# Altium schematic sheet SCH_2022-03-13.schdoc
size 288 x 399 mm
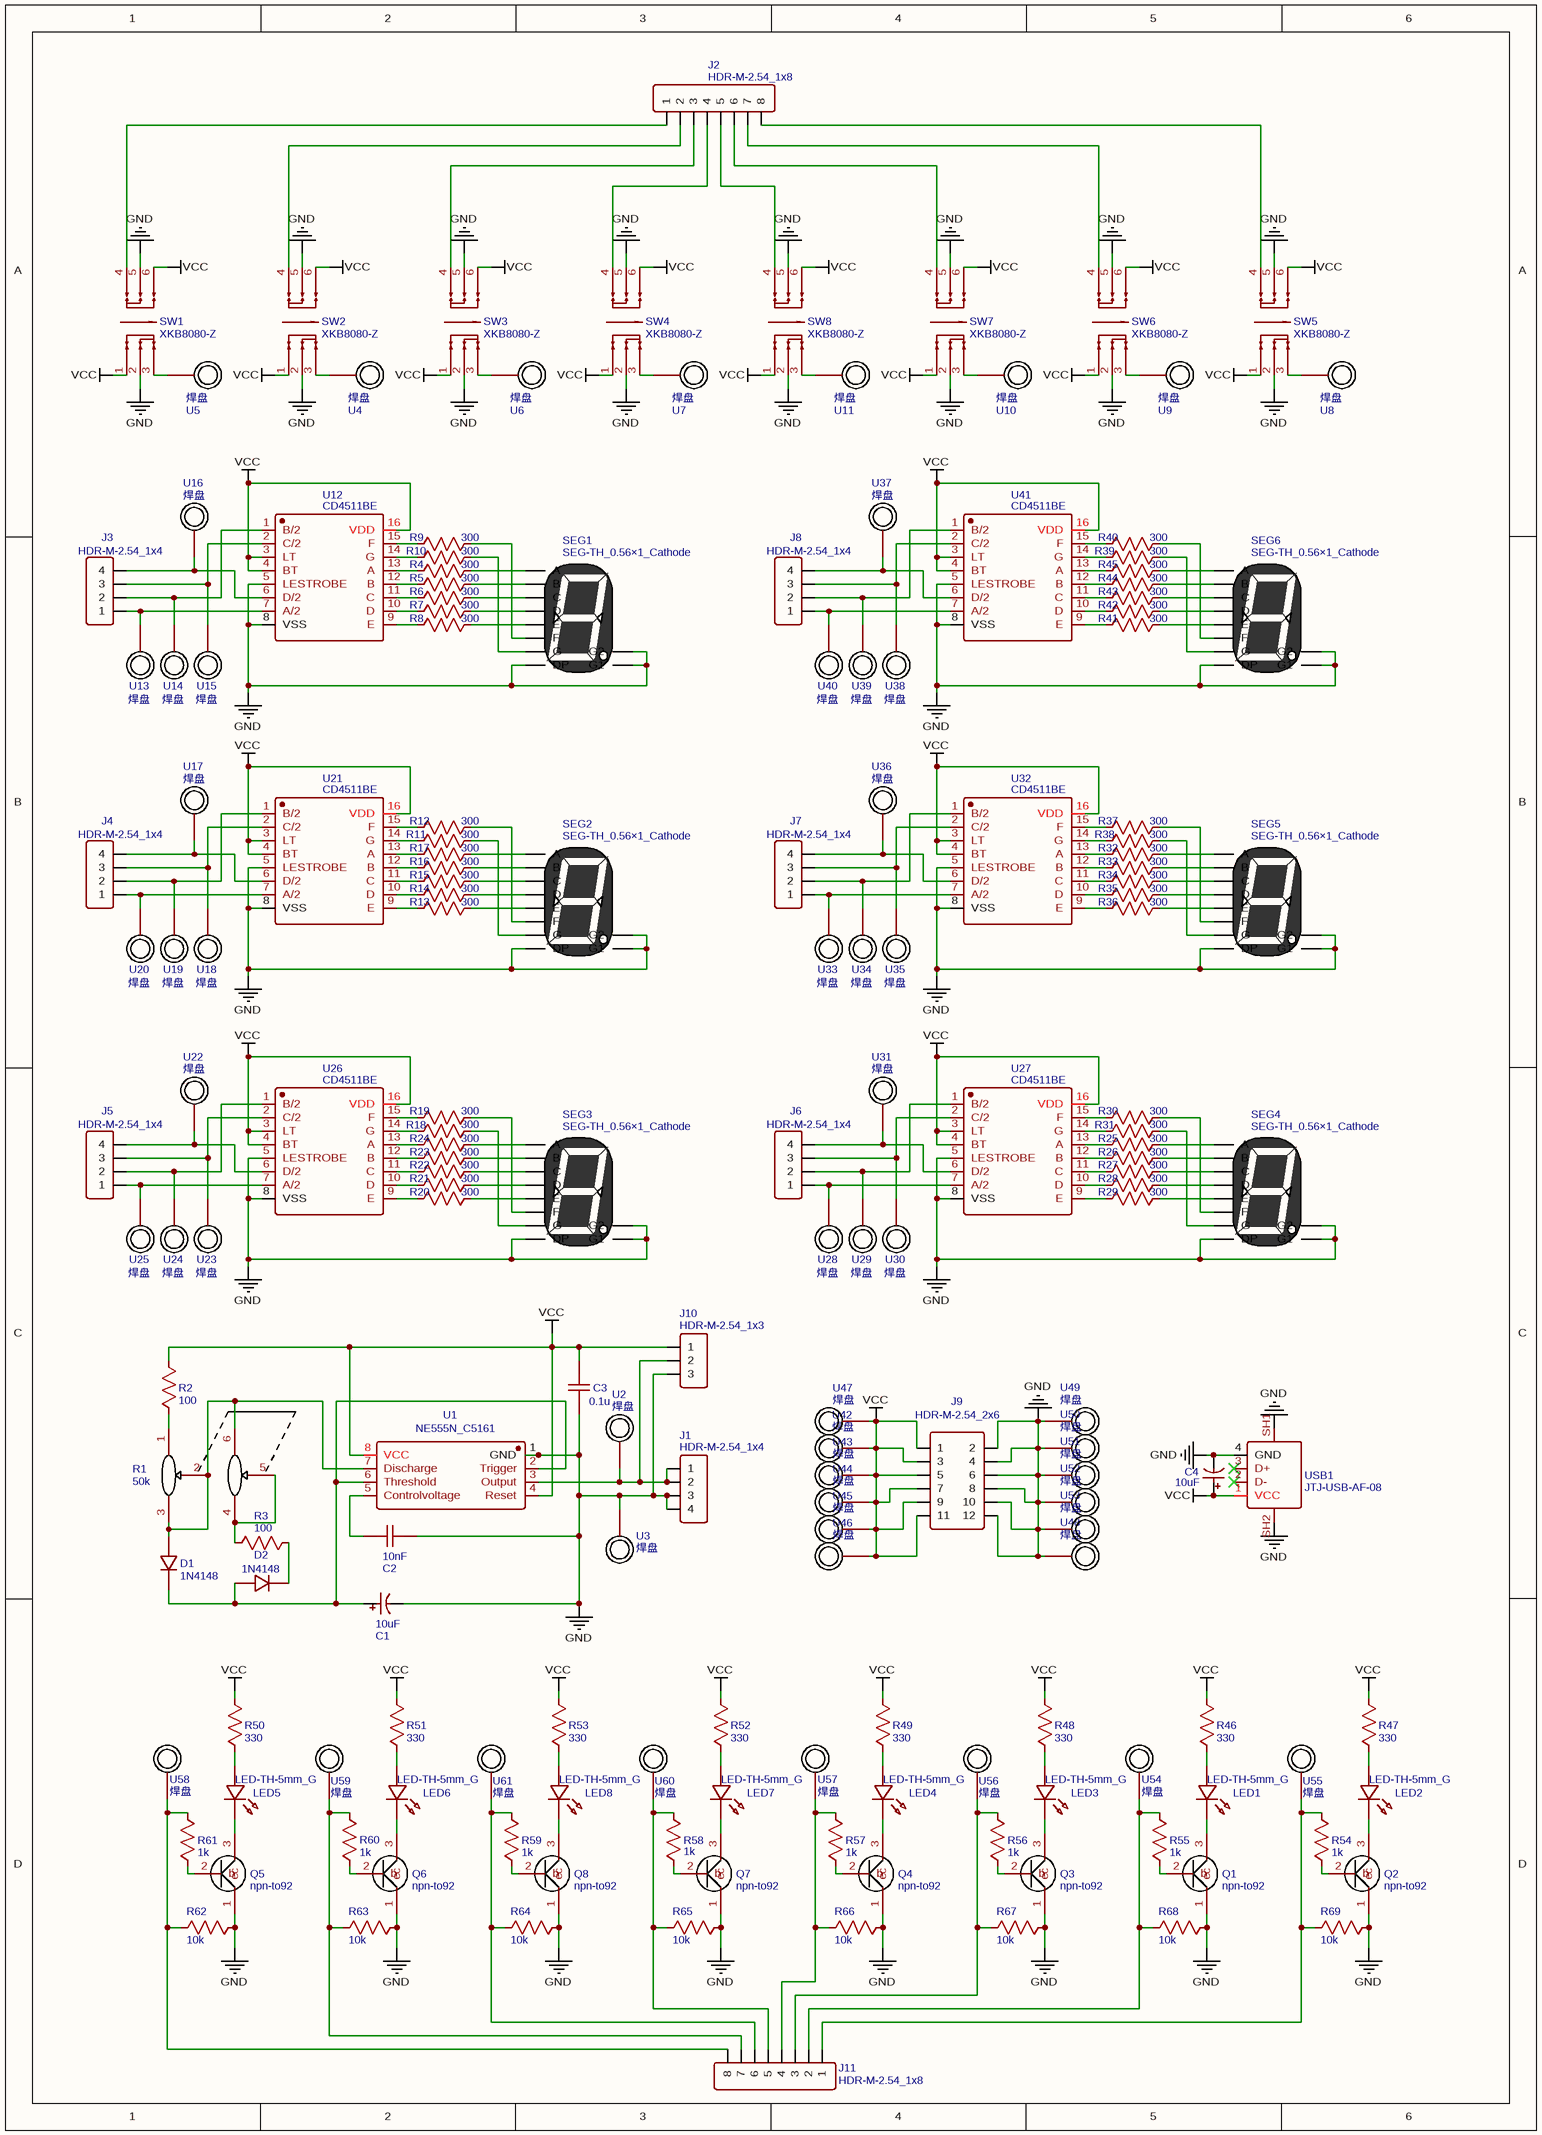
[diagram p0: SCH_2022-03-13.schdoc]

## Parts
C1  10uF  [CAP-TH_BD1.0-P2.54-D6.3-FD]
C2  10nF  [RAD-0.2]
C3  0.1u  [RAD-0.2]
C4  10uF  [CAP-TH_BD1.0-P2.54-D6.3-FD]
D1  1N4148  [DO-35_BD2.0-L4.2-P8.20-D0.5-RD]
D2  1N4148  [DO-35_BD2.0-L4.2-P8.20-D0.5-RD]
J1  HDR-M-2.54_1x4  [HDR-M-2.54_1X4]
J2  HDR-M-2.54_1x8  [HDR-M-2.54_1X8]
J3  HDR-M-2.54_1x4  [HDR-M-2.54_1X4]
J4  HDR-M-2.54_1x4  [HDR-M-2.54_1X4]
J5  HDR-M-2.54_1x4  [HDR-M-2.54_1X4]
J6  HDR-M-2.54_1x4  [HDR-M-2.54_1X4]
J7  HDR-M-2.54_1x4  [HDR-M-2.54_1X4]
J8  HDR-M-2.54_1x4  [HDR-M-2.54_1X4]
J9  HDR-M-2.54_2x6  [HDR-M-2.54_2X6]
J10  HDR-M-2.54_1x3  [HDR-M-2.54_1X3]
J11  HDR-M-2.54_1x8  [HDR-M-2.54_1X8]
LED1  LED-TH-5mm_G  [LED-TH_BD5.0_GREEN]
LED2  LED-TH-5mm_G  [LED-TH_BD5.0_GREEN]
LED3  LED-TH-5mm_G  [LED-TH_BD5.0_GREEN]
LED4  LED-TH-5mm_G  [LED-TH_BD5.0_GREEN]
LED5  LED-TH-5mm_G  [LED-TH_BD5.0_GREEN]
LED6  LED-TH-5mm_G  [LED-TH_BD5.0_GREEN]
LED7  LED-TH-5mm_G  [LED-TH_BD5.0_GREEN]
LED8  LED-TH-5mm_G  [LED-TH_BD5.0_GREEN]
Q1  npn-to92  [NPN——TO92]
Q2  npn-to92  [NPN——TO92]
Q3  npn-to92  [NPN——TO92]
Q4  npn-to92  [NPN——TO92]
Q5  npn-to92  [NPN——TO92]
Q6  npn-to92  [NPN——TO92]
Q7  npn-to92  [NPN——TO92]
Q8  npn-to92  [NPN——TO92]
R1  50k  [WH148双联电位器]
R2  100  [R_AXIAL-0.4]
R3  100  [R_AXIAL-0.4]
R4  300  [R_AXIAL-0.4]
R5  300  [R_AXIAL-0.4]
R6  300  [R_AXIAL-0.4]
R7  300  [R_AXIAL-0.4]
R8  300  [R_AXIAL-0.4]
R9  300  [R_AXIAL-0.4]
R10  300  [R_AXIAL-0.4]
R11  300  [R_AXIAL-0.4]
R12  300  [R_AXIAL-0.4]
R13  300  [R_AXIAL-0.4]
R14  300  [R_AXIAL-0.4]
R15  300  [R_AXIAL-0.4]
R16  300  [R_AXIAL-0.4]
R17  300  [R_AXIAL-0.4]
R18  300  [R_AXIAL-0.4]
R19  300  [R_AXIAL-0.4]
R20  300  [R_AXIAL-0.4]
R21  300  [R_AXIAL-0.4]
R22  300  [R_AXIAL-0.4]
R23  300  [R_AXIAL-0.4]
R24  300  [R_AXIAL-0.4]
R25  300  [R_AXIAL-0.4]
R26  300  [R_AXIAL-0.4]
R27  300  [R_AXIAL-0.4]
R28  300  [R_AXIAL-0.4]
R29  300  [R_AXIAL-0.4]
R30  300  [R_AXIAL-0.4]
R31  300  [R_AXIAL-0.4]
R32  300  [R_AXIAL-0.4]
R33  300  [R_AXIAL-0.4]
R34  300  [R_AXIAL-0.4]
R35  300  [R_AXIAL-0.4]
R36  300  [R_AXIAL-0.4]
R37  300  [R_AXIAL-0.4]
R38  300  [R_AXIAL-0.4]
R39  300  [R_AXIAL-0.4]
R40  300  [R_AXIAL-0.4]
R41  300  [R_AXIAL-0.4]
R42  300  [R_AXIAL-0.4]
R43  300  [R_AXIAL-0.4]
R44  300  [R_AXIAL-0.4]
R45  300  [R_AXIAL-0.4]
R46  330  [R_AXIAL-0.4]
R47  330  [R_AXIAL-0.4]
R48  330  [R_AXIAL-0.4]
R49  330  [R_AXIAL-0.4]
R50  330  [R_AXIAL-0.4]
R51  330  [R_AXIAL-0.4]
R52  330  [R_AXIAL-0.4]
R53  330  [R_AXIAL-0.4]
R54  1k  [R_AXIAL-0.4]
R55  1k  [R_AXIAL-0.4]
R56  1k  [R_AXIAL-0.4]
R57  1k  [R_AXIAL-0.4]
R58  1k  [R_AXIAL-0.4]
R59  1k  [R_AXIAL-0.4]
R60  1k  [R_AXIAL-0.4]
R61  1k  [R_AXIAL-0.4]
R62  10k  [R_AXIAL-0.4]
R63  10k  [R_AXIAL-0.4]
R64  10k  [R_AXIAL-0.4]
R65  10k  [R_AXIAL-0.4]
R66  10k  [R_AXIAL-0.4]
R67  10k  [R_AXIAL-0.4]
R68  10k  [R_AXIAL-0.4]
R69  10k  [R_AXIAL-0.4]
SEG1  SEG-TH_0.56×1_Cathode  [LED-SEG-TH_10P-L12.6-W19.0-P2.54-S15.24-BL]
SEG2  SEG-TH_0.56×1_Cathode  [LED-SEG-TH_10P-L12.6-W19.0-P2.54-S15.24-BL]
SEG3  SEG-TH_0.56×1_Cathode  [LED-SEG-TH_10P-L12.6-W19.0-P2.54-S15.24-BL]
SEG4  SEG-TH_0.56×1_Cathode  [LED-SEG-TH_10P-L12.6-W19.0-P2.54-S15.24-BL]
SEG5  SEG-TH_0.56×1_Cathode  [LED-SEG-TH_10P-L12.6-W19.0-P2.54-S15.24-BL]
SEG6  SEG-TH_0.56×1_Cathode  [LED-SEG-TH_10P-L12.6-W19.0-P2.54-S15.24-BL]
SW1  XKB8080-Z  [SW-TH_6P-L8.0-W8.0-P2.50]
SW2  XKB8080-Z  [SW-TH_6P-L8.0-W8.0-P2.50]
SW3  XKB8080-Z  [SW-TH_6P-L8.0-W8.0-P2.50]
SW4  XKB8080-Z  [SW-TH_6P-L8.0-W8.0-P2.50]
SW5  XKB8080-Z  [SW-TH_6P-L8.0-W8.0-P2.50]
SW6  XKB8080-Z  [SW-TH_6P-L8.0-W8.0-P2.50]
SW7  XKB8080-Z  [SW-TH_6P-L8.0-W8.0-P2.50]
SW8  XKB8080-Z  [SW-TH_6P-L8.0-W8.0-P2.50]
U1  NE555N_C5161  [DIP-8_L9.7-W6.4-P2.54-LS7.6-BL]
U2  焊盘  [6*4焊盘]
U3  焊盘  [6*4焊盘]
U4  焊盘  [6*4焊盘]
U5  焊盘  [6*4焊盘]
U6  焊盘  [6*4焊盘]
U7  焊盘  [6*4焊盘]
U8  焊盘  [6*4焊盘]
U9  焊盘  [6*4焊盘]
U10  焊盘  [6*4焊盘]
U11  焊盘  [6*4焊盘]
U12  CD4511BE  [DIP-16_L19.8-W6.5-P2.54-LS7.6-BL]
U13  焊盘  [6*4焊盘]
U14  焊盘  [6*4焊盘]
U15  焊盘  [6*4焊盘]
U16  焊盘  [6*4焊盘]
U17  焊盘  [6*4焊盘]
U18  焊盘  [6*4焊盘]
U19  焊盘  [6*4焊盘]
U20  焊盘  [6*4焊盘]
U21  CD4511BE  [DIP-16_L19.8-W6.5-P2.54-LS7.6-BL]
U22  焊盘  [6*4焊盘]
U23  焊盘  [6*4焊盘]
U24  焊盘  [6*4焊盘]
U25  焊盘  [6*4焊盘]
U26  CD4511BE  [DIP-16_L19.8-W6.5-P2.54-LS7.6-BL]
U27  CD4511BE  [DIP-16_L19.8-W6.5-P2.54-LS7.6-BL]
U28  焊盘  [6*4焊盘]
U29  焊盘  [6*4焊盘]
U30  焊盘  [6*4焊盘]
U31  焊盘  [6*4焊盘]
U32  CD4511BE  [DIP-16_L19.8-W6.5-P2.54-LS7.6-BL]
U33  焊盘  [6*4焊盘]
U34  焊盘  [6*4焊盘]
U35  焊盘  [6*4焊盘]
U36  焊盘  [6*4焊盘]
U37  焊盘  [6*4焊盘]
U38  焊盘  [6*4焊盘]
U39  焊盘  [6*4焊盘]
U40  焊盘  [6*4焊盘]
U41  CD4511BE  [DIP-16_L19.8-W6.5-P2.54-LS7.6-BL]
U42  焊盘  [6*4焊盘]
U43  焊盘  [6*4焊盘]
U44  焊盘  [6*4焊盘]
U45  焊盘  [6*4焊盘]
U46  焊盘  [6*4焊盘]
U47  焊盘  [6*4焊盘]
U48  焊盘  [6*4焊盘]
U49  焊盘  [6*4焊盘]
U50  焊盘  [6*4焊盘]
U51  焊盘  [6*4焊盘]
U52  焊盘  [6*4焊盘]
U53  焊盘  [6*4焊盘]
U54  焊盘  [6*4焊盘]
U55  焊盘  [6*4焊盘]
U56  焊盘  [6*4焊盘]
U57  焊盘  [6*4焊盘]
U58  焊盘  [6*4焊盘]
U59  焊盘  [6*4焊盘]
U60  焊盘  [6*4焊盘]
U61  焊盘  [6*4焊盘]
USB1  JTJ-USB-AF-08  [USB-A-TH__USB-AF-90]

## Nets
GND: C1.2 C2.1 C3.1 C4.2 J1.3 J1.4 J9.2 J9.4 J9.6 J9.8 J9.10 J9.12 J10.3 Q1.1(e) Q2.1(e) Q3.1(e) Q4.1(e) Q5.1(e) Q6.1(e) Q7.1(e) Q8.1(e) R62.1 R63.1 R64.1 R65.1 R66.1 R67.1 R68.1 R69.1 SEG1.3(G1) SEG1.5(DP) SEG1.8(G2) SEG2.3(G1) SEG2.5(DP) SEG2.8(G2) SEG3.3(G1) SEG3.5(DP) SEG3.8(G2) SEG4.3(G1) SEG4.5(DP) SEG4.8(G2) SEG5.3(G1) SEG5.5(DP) SEG5.8(G2) SEG6.3(G1) SEG6.5(DP) SEG6.8(G2) SW1.2 SW1.5 SW2.2 SW2.5 SW3.2 SW3.5 SW4.2 SW4.5 SW5.2 SW5.5 SW6.2 SW6.5 SW7.2 SW7.5 SW8.2 SW8.5 U1.1(GND) U3.1 U12.5(LESTROBE) U12.8(VSS) U21.5(LESTROBE) U21.8(VSS) U26.5(LESTROBE) U26.8(VSS) U27.5(LESTROBE) U27.8(VSS) U32.5(LESTROBE) U32.8(VSS) U41.5(LESTROBE) U41.8(VSS) U48.1 U49.1 U50.1 U51.1 U52.1 U53.1 USB1.4(GND) USB1.SH1 USB1.SH2
VCC: C3.2 C4.1 J9.1 J9.3 J9.5 J9.7 J9.9 J9.11 J10.1 R2.2 R46.2 R47.2 R48.2 R49.2 R50.2 R51.2 R52.2 R53.2 SW1.1 SW1.6 SW2.1 SW2.6 SW3.1 SW3.6 SW4.1 SW4.6 SW5.1 SW5.6 SW6.1 SW6.6 SW7.1 SW7.6 SW8.1 SW8.6 U1.4(Reset) U1.8(VCC) U12.3(LT) U12.4(BT) U12.16(VDD) U21.3(LT) U21.4(BT) U21.16(VDD) U26.3(LT) U26.4(BT) U26.16(VDD) U27.3(LT) U27.4(BT) U27.16(VDD) U32.3(LT) U32.4(BT) U32.16(VDD) U41.3(LT) U41.4(BT) U41.16(VDD) U42.1 U43.1 U44.1 U45.1 U46.1 U47.1 USB1.1(VCC)
NetC1_1: C1.1 D1.1 D2.2 U1.2(Trigger) U1.6(Threshold)
NetC2_2: C2.2 U1.5(Controlvoltage)
NetD1_2: D1.2 R1.2 R1.3 R1.6 U1.7(Discharge)
NetD2_1: D2.1 R3.2
NetJ1_1: J1.1 J1.2 J10.2 U1.3(Output) U2.1
NetJ2_1: J2.1 SW1.4
NetJ2_2: J2.2 SW2.4
NetJ2_3: J2.3 SW3.4
NetJ2_4: J2.4 SW4.4
NetJ2_5: J2.5 SW8.4
NetJ2_6: J2.6 SW7.4
NetJ2_7: J2.7 SW6.4
NetJ2_8: J2.8 SW5.4
NetJ3_1: J3.1 U12.7(A/2) U13.1
NetJ3_2: J3.2 U12.1(B/2) U14.1
NetJ3_3: J3.3 U12.2(C/2) U15.1
NetJ3_4: J3.4 U12.6(D/2) U16.1
NetJ4_1: J4.1 U20.1 U21.7(A/2)
NetJ4_2: J4.2 U19.1 U21.1(B/2)
NetJ4_3: J4.3 U18.1 U21.2(C/2)
NetJ4_4: J4.4 U17.1 U21.6(D/2)
NetJ5_1: J5.1 U25.1 U26.7(A/2)
NetJ5_2: J5.2 U24.1 U26.1(B/2)
NetJ5_3: J5.3 U23.1 U26.2(C/2)
NetJ5_4: J5.4 U22.1 U26.6(D/2)
NetJ6_1: J6.1 U27.7(A/2) U28.1
NetJ6_2: J6.2 U27.1(B/2) U29.1
NetJ6_3: J6.3 U27.2(C/2) U30.1
NetJ6_4: J6.4 U27.6(D/2) U31.1
NetJ7_1: J7.1 U32.7(A/2) U33.1
NetJ7_2: J7.2 U32.1(B/2) U34.1
NetJ7_3: J7.3 U32.2(C/2) U35.1
NetJ7_4: J7.4 U32.6(D/2) U36.1
NetJ8_1: J8.1 U40.1 U41.7(A/2)
NetJ8_2: J8.2 U39.1 U41.1(B/2)
NetJ8_3: J8.3 U38.1 U41.2(C/2)
NetJ8_4: J8.4 U37.1 U41.6(D/2)
NetJ11_1: J11.1 R54.2 R69.2 U55.1
NetJ11_2: J11.2 R55.2 R68.2 U54.1
NetJ11_3: J11.3 R56.2 R67.2 U56.1
NetJ11_4: J11.4 R57.2 R66.2 U57.1
NetJ11_5: J11.5 R58.2 R65.2 U60.1
NetJ11_6: J11.6 R59.2 R64.2 U61.1
NetJ11_7: J11.7 R60.2 R63.2 U59.1
NetJ11_8: J11.8 R61.2 R62.2 U58.1
NetLED1_1: LED1.1 R46.1
NetLED1_2: LED1.2 Q1.3(c)
NetLED2_1: LED2.1 R47.1
NetLED2_2: LED2.2 Q2.3(c)
NetLED3_1: LED3.1 R48.1
NetLED3_2: LED3.2 Q3.3(c)
NetLED4_1: LED4.1 R49.1
NetLED4_2: LED4.2 Q4.3(c)
NetLED5_1: LED5.1 R50.1
NetLED5_2: LED5.2 Q5.3(c)
NetLED6_1: LED6.1 R51.1
NetLED6_2: LED6.2 Q6.3(c)
NetLED7_1: LED7.1 R52.1
NetLED7_2: LED7.2 Q7.3(c)
NetLED8_1: LED8.1 R53.1
NetLED8_2: LED8.2 Q8.3(c)
NetQ1_2: Q1.2(b) R55.1
NetQ2_2: Q2.2(b) R54.1
NetQ3_2: Q3.2(b) R56.1
NetQ4_2: Q4.2(b) R57.1
NetQ5_2: Q5.2(b) R61.1
NetQ6_2: Q6.2(b) R60.1
NetQ7_2: Q7.2(b) R58.1
NetQ8_2: Q8.2(b) R59.1
NetR1_1: R1.1 R2.1
NetR1_4: R1.4 R1.5 R3.1
NetR4_1: R4.1 U12.13(A)
NetR4_2: R4.2 SEG1.7(A)
NetR5_1: R5.1 U12.12(B)
NetR5_2: R5.2 SEG1.6(B)
NetR6_1: R6.1 U12.11(C)
NetR6_2: R6.2 SEG1.4(C)
NetR7_1: R7.1 U12.10(D)
NetR7_2: R7.2 SEG1.2(D)
NetR8_1: R8.1 U12.9(E)
NetR8_2: R8.2 SEG1.1(E)
NetR9_1: R9.1 U12.15(F)
NetR9_2: R9.2 SEG1.9(F)
NetR10_1: R10.1 U12.14(G)
NetR10_2: R10.2 SEG1.10(G)
NetR11_1: R11.1 U21.14(G)
NetR11_2: R11.2 SEG2.10(G)
NetR12_1: R12.1 U21.15(F)
NetR12_2: R12.2 SEG2.9(F)
NetR13_1: R13.1 U21.9(E)
NetR13_2: R13.2 SEG2.1(E)
NetR14_1: R14.1 U21.10(D)
NetR14_2: R14.2 SEG2.2(D)
NetR15_1: R15.1 U21.11(C)
NetR15_2: R15.2 SEG2.4(C)
NetR16_1: R16.1 U21.12(B)
NetR16_2: R16.2 SEG2.6(B)
NetR17_1: R17.1 U21.13(A)
NetR17_2: R17.2 SEG2.7(A)
NetR18_1: R18.1 U26.14(G)
NetR18_2: R18.2 SEG3.10(G)
NetR19_1: R19.1 U26.15(F)
NetR19_2: R19.2 SEG3.9(F)
NetR20_1: R20.1 U26.9(E)
NetR20_2: R20.2 SEG3.1(E)
NetR21_1: R21.1 U26.10(D)
NetR21_2: R21.2 SEG3.2(D)
NetR22_1: R22.1 U26.11(C)
NetR22_2: R22.2 SEG3.4(C)
NetR23_1: R23.1 U26.12(B)
NetR23_2: R23.2 SEG3.6(B)
NetR24_1: R24.1 U26.13(A)
NetR24_2: R24.2 SEG3.7(A)
NetR25_1: R25.1 U27.13(A)
NetR25_2: R25.2 SEG4.7(A)
NetR26_1: R26.1 U27.12(B)
NetR26_2: R26.2 SEG4.6(B)
NetR27_1: R27.1 U27.11(C)
NetR27_2: R27.2 SEG4.4(C)
NetR28_1: R28.1 U27.10(D)
NetR28_2: R28.2 SEG4.2(D)
NetR29_1: R29.1 U27.9(E)
NetR29_2: R29.2 SEG4.1(E)
NetR30_1: R30.1 U27.15(F)
NetR30_2: R30.2 SEG4.9(F)
NetR31_1: R31.1 U27.14(G)
NetR31_2: R31.2 SEG4.10(G)
NetR32_1: R32.1 U32.13(A)
NetR32_2: R32.2 SEG5.7(A)
NetR33_1: R33.1 U32.12(B)
NetR33_2: R33.2 SEG5.6(B)
NetR34_1: R34.1 U32.11(C)
NetR34_2: R34.2 SEG5.4(C)
NetR35_1: R35.1 U32.10(D)
NetR35_2: R35.2 SEG5.2(D)
NetR36_1: R36.1 U32.9(E)
NetR36_2: R36.2 SEG5.1(E)
NetR37_1: R37.1 U32.15(F)
NetR37_2: R37.2 SEG5.9(F)
NetR38_1: R38.1 U32.14(G)
NetR38_2: R38.2 SEG5.10(G)
NetR39_1: R39.1 U41.14(G)
NetR39_2: R39.2 SEG6.10(G)
NetR40_1: R40.1 U41.15(F)
NetR40_2: R40.2 SEG6.9(F)
NetR41_1: R41.1 U41.9(E)
NetR41_2: R41.2 SEG6.1(E)
NetR42_1: R42.1 U41.10(D)
NetR42_2: R42.2 SEG6.2(D)
NetR43_1: R43.1 U41.11(C)
NetR43_2: R43.2 SEG6.4(C)
NetR44_1: R44.1 U41.12(B)
NetR44_2: R44.2 SEG6.6(B)
NetR45_1: R45.1 U41.13(A)
NetR45_2: R45.2 SEG6.7(A)
NetSW1_3: SW1.3 U5.1
NetSW2_3: SW2.3 U4.1
NetSW3_3: SW3.3 U6.1
NetSW4_3: SW4.3 U7.1
NetSW5_3: SW5.3 U8.1
NetSW6_3: SW6.3 U9.1
NetSW7_3: SW7.3 U10.1
NetSW8_3: SW8.3 U11.1

Not connected (* = marked no-connect by the designer): USB1 2(D-)* 3(D+)*

## Library data of the parts
C1 C4 = 10uF: BOM_Manufacturer: ValuePro; BOM_Manufacturer Part: 100uF 35V 6.3*11; Value: 100uF; BOM_Supplier Part: C45076; BOM_Supplier: LCSC; spicePre: C; spiceSymbolName: 100uF 35V 6.3*11_C45076
C2 = 10nF: nameAlias: Value(F); Contributor: LCEDA_Lib; spicePre: C; spiceSymbolName: C_RAD-0.2_US
C3 = 0.1u: nameAlias: Value(F); Contributor: LCEDA_Lib; spicePre: C; spiceSymbolName: C_RAD-0.2_US
D1 D2 = 1N4148: BOM_Manufacturer: STMicroelectronics; Contributor: LCSC; BOM_Supplier: LCSC; BOM_Supplier Part: C13769; BOM_Manufacturer Part: 1N4148; spicePre: D; spiceSymbolName: 1N4148
J1 J3-J8 = HDR-M-2.54_1x4: Contributor: LCEDA_Lib; BOM_Supplier Part: C124378; BOM_Supplier: LCSC; spicePre: J; spiceSymbolName: HDR-M-2.54_1x4
J2 J11 = HDR-M-2.54_1x8: Contributor: LCEDA_Lib; BOM_Supplier Part: C190820; BOM_Supplier: LCSC; spicePre: J; spiceSymbolName: HDR-M-2.54_1x8
J9 = HDR-M-2.54_2x6: Contributor: LCEDA_Lib; BOM_Supplier Part: C124388; BOM_Supplier: LCSC; spicePre: J; spiceSymbolName: HDR-M-2.54_2x6
J10 = HDR-M-2.54_1x3: Contributor: LCEDA_Lib; BOM_Supplier Part: C180248; BOM_Supplier: LCSC; spicePre: J; spiceSymbolName: HDR-M-2.54_1x3
LED1-LED8 = LED-TH-5mm_G: BOM_Manufacturer: EVERLIGHT(台湾亿光); BOM_Manufacturer Part: 333-2SYGD/S530-E2; Contributor: LCEDA_Lib; BOM_Supplier Part: C88163; BOM_Supplier: LCSC; spicePre: L; spiceSymbolName: LED-TH-5mm_G
Q1-Q8 = npn-to92: Contributor: zdy123; spicePre: Q; spiceSymbolName: npn-to92
R1 = 50k: Contributor: lixiansen23333; spicePre: C; spiceSymbolName: WH148双联电位器
R2 R3 = 100: nameAlias: Value(Ω); Contributor: LCEDA_Lib; spicePre: R; spiceSymbolName: R_AXIAL-0.4_US
R4-R45 = 300: nameAlias: Value(Ω); Contributor: LCEDA_Lib; spicePre: R; spiceSymbolName: R_AXIAL-0.4_US
R46-R53 = 330: nameAlias: Value(Ω); Contributor: LCEDA_Lib; spicePre: R; spiceSymbolName: R_AXIAL-0.4_US
R54-R69 = 2k: nameAlias: Value(Ω); Contributor: LCEDA_Lib; spicePre: R; spiceSymbolName: R_AXIAL-0.4_US
SEG1-SEG6 = SEG-TH_0.56×1_Cathode: BOM_Manufacturer: 志浩; Contributor: LCEDA_01; BOM_Supplier Part: C8093; spicePre: S; spiceSymbolName: SEG-TH_0.56×1_Cathode
SW1-SW8 = XKB8080-Z: BOM_Manufacturer: XKB Enterprise; Contributor: LCSC; BOM_Supplier: LCSC; BOM_Supplier Part: C318860; BOM_Manufacturer Part: XKB8080-Z; BOM_JLCPCB Part Class: Extended Part; spicePre: S; spiceSymbolName: XKB8080-Z
U1 = NE555N_C5161: BOM_Manufacturer: ST(意法半导体); BOM_Manufacturer Part: NE555N; Contributor: LCSC; BOM_Supplier: LCSC; BOM_Supplier Part: C5161; BOM_JLCPCB Part Class: Extended Part; spicePre: U; spiceSymbolName: NE555N_C5161
U2-U11 U13-U20 U22-U25 U28-U31 U33-U40 U42-U61 = 焊盘: Contributor: dhx233; spicePre: U; spiceSymbolName: 焊盘
U12 U21 U26 U27 U32 U41 = CD4511BE: BOM_Manufacturer: TI; spicePre: X; BOM_Supplier: LCSC; BOM_Manufacturer Part: CD4511BE; BOM_Supplier Part: C5327; BOM_JLCPCB Part Class: Extended Part; spiceSymbolName: CD4511BE
USB1 = JTJ-USB-AF-08: Contributor: LCSC; BOM_Supplier: LCSC; BOM_Manufacturer Part: JTJ-USB-AF-08; BOM_Supplier Part: C2345; BOM_JLCPCB Part Class: Extended Part; spicePre: U; spiceSymbolName: JTJ-USB-AF-08